# Altium schematic sheet LCD Oled.SchDoc
size A4; SheetNumber: 6; SheetTotal: 9
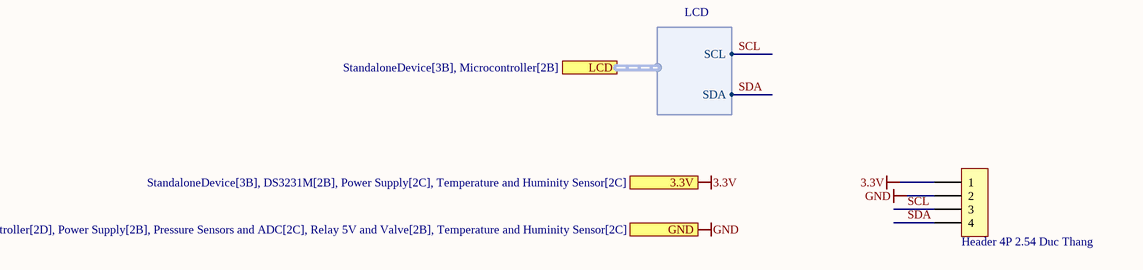
[diagram p0: LCD Oled.SchDoc]

## Parts
LCD  Header 4P 2.54 Duc Thang  [XH2.54M-4]

## Ports
3.3V (see StandaloneDevice[3B], DS3231M[2B], Power Supply[2C], Temperature and Huminity Sensor[2C]), GND (see StandaloneDevice[3B], DS3231M[2B], Microcontroller[2D], Power Supply[2B], Pressure Sensors and ADC[2C], Relay 5V and Valve[2B], Temperature and Huminity Sensor[2C]), LCD (harness LCD, see StandaloneDevice[3B], Microcontroller[2B])

## Harnesses
LCD: SCL, SDA

## Nets
3.3V: LCD.1 ; port 3.3V
GND: LCD.2 ; port GND
SCL: LCD.3 ; port LCD.SCL
SDA: LCD.4 ; port LCD.SDA

## Library data of the parts
LCD = Header 4P 2.54 Duc Thang: Cắm; Ten_Linh_Kien: Header 4P XH2.54-4P Đực Thẳng; Don_Vi: Con; Ma_Hang: MH001285; Chung_Loai: Cắm